# EAGLE design TermometrZbiornikaAkumulacyjnego (EAGLE 6.4)
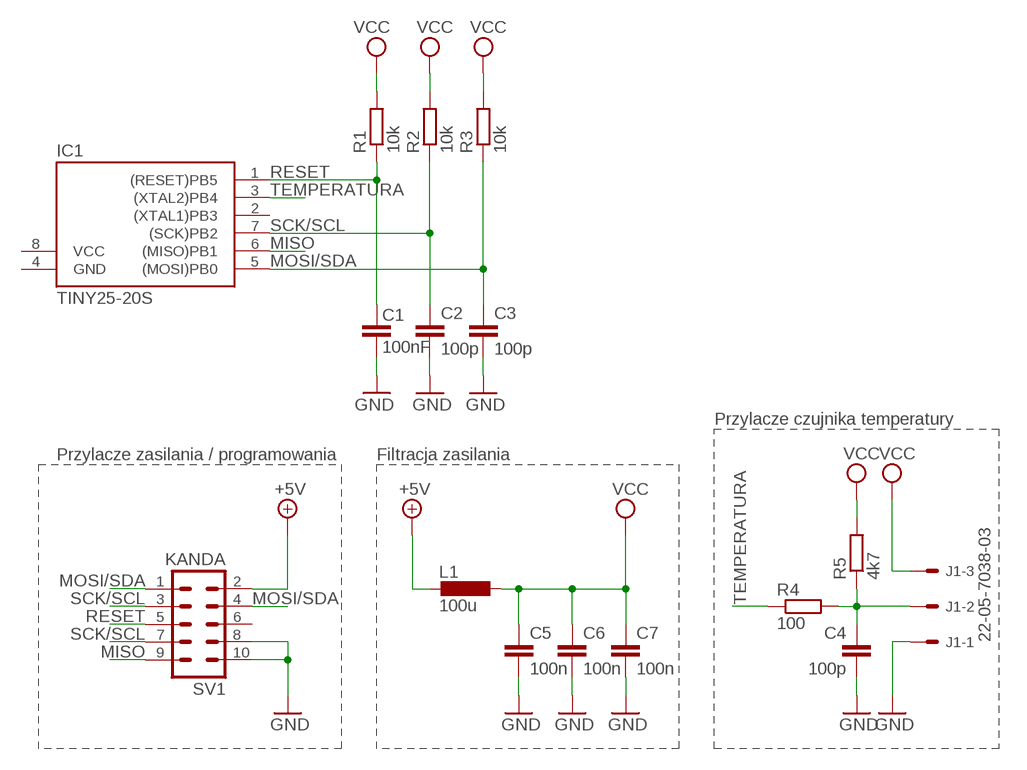
[diagram p0: schematic, sheet 1]

## Parts
C1  100nF  C-EUC1206  [C1206]
C2  100p  C-EUC1206  [C1206]
C3  100p  C-EUC1206  [C1206]
C4  100p  C-EUC1206  [C1206]
C5  100n  C-EUC1206  [C1206]
C6  100n  C-EUC1206  [C1206]
C7  100n  C-EUC1206  [C1206]
IC1  TINY25-20S  [SOIC8]
J1  22-05-7038-03  [7395-03]
L1  100u  L-EUL1210  [R1210]
R1  10k  R-EU_R1206  [R1206]
R2  10k  R-EU_R1206  [R1206]
R3  10k  R-EU_R1206  [R1206]
R4  100  R-EU_R1206  [R1206]
R5  4k7  R-EU_R1206  [R1206]
SV1  KANDA  ML10L  [ML10L]

## Nets
+5V: L1.2 SV1.2
GND: C1.2 C2.2 C3.2 C4.2 C5.2 C6.2 C7.2 J1.1 SV1.8 SV1.10
MISO: IC1.6((MISO)PB1) SV1.9
MOSI/SDA: C3.1 IC1.5((MOSI)PB0) R3.1 SV1.1 SV1.4
N$2: C4.1 J1.2 R4.2 R5.1
RESET: C1.1 IC1.1((RESET)PB5) R1.1 SV1.5
SCK/SCL: C2.1 IC1.7((SCK)PB2) R2.1 SV1.3 SV1.7
TEMPERATURA: IC1.3((XTAL2)PB4) R4.1
VCC: C5.1 C6.1 C7.1 J1.3 L1.1 R1.2 R2.2 R3.2 R5.2
Unconnected: IC1.2((XTAL1)PB3) SV1.6

## Notes on the sheet
- Przylacze czujnika temperatury
- Przylacze zasilania / programowania | Filtracja zasilania

## Power pins joined to a net without a drawn wire
GND: IC1.4(GND)
VCC: IC1.8(VCC)

## Library data of the parts
C1 = resistor:C-EU: CAPACITOR, European symbol
C2-C7 = rcl:C-EU: CAPACITOR, European symbol
IC1 = atmel:TINY25: 8-bit Microcontroller with 2KFlash
J1 = con-molex:22-?-03: CONNECTOR wire to board 2.54 mm (.1 inch) pitch header; OC_FARNELL: unknown; OC_NEWARK: unknown
L1 = rcl:L-EU: INDUCTOR, European symbol
R1-R5 = rcl:R-EU_: RESISTOR, European symbol
SV1 = con-harting-ml:ML10: HARTING; OC_FARNELL: unknown; OC_NEWARK: unknown

## Net classes
0 default: clearance 0.355 mm

## Board
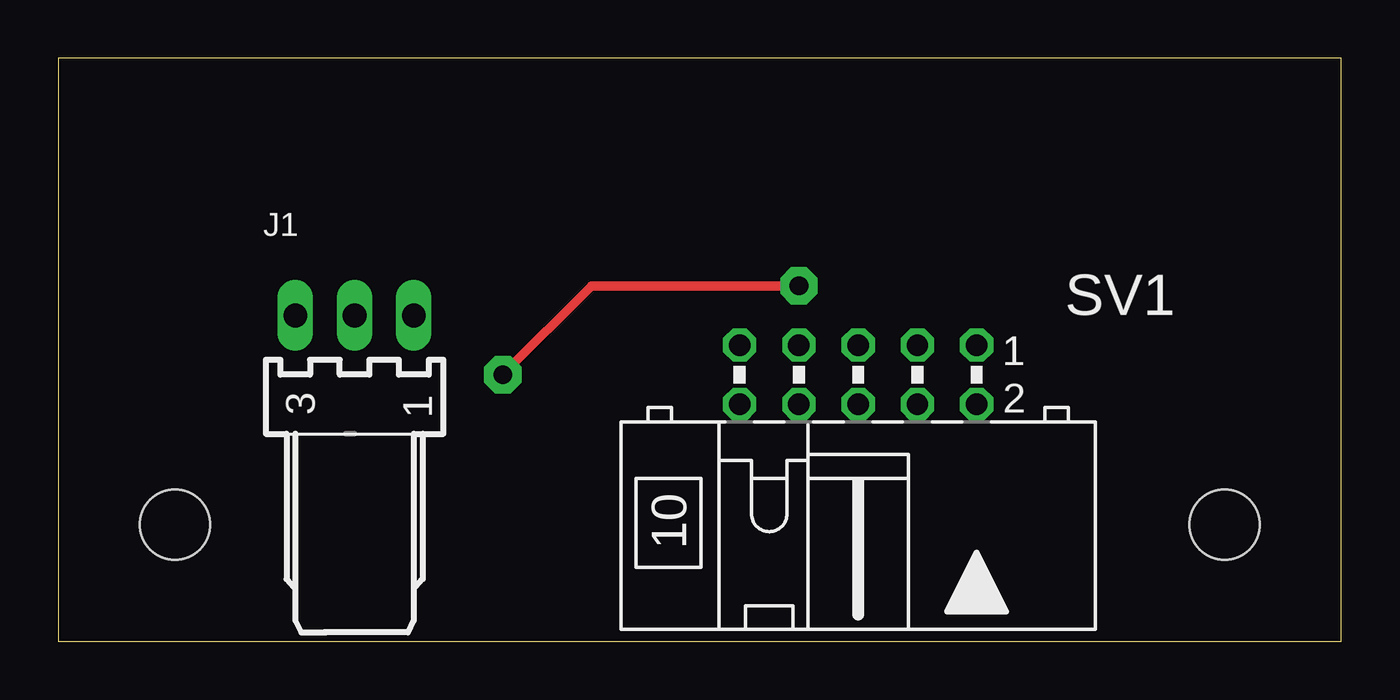
[diagram p1: board, top side]
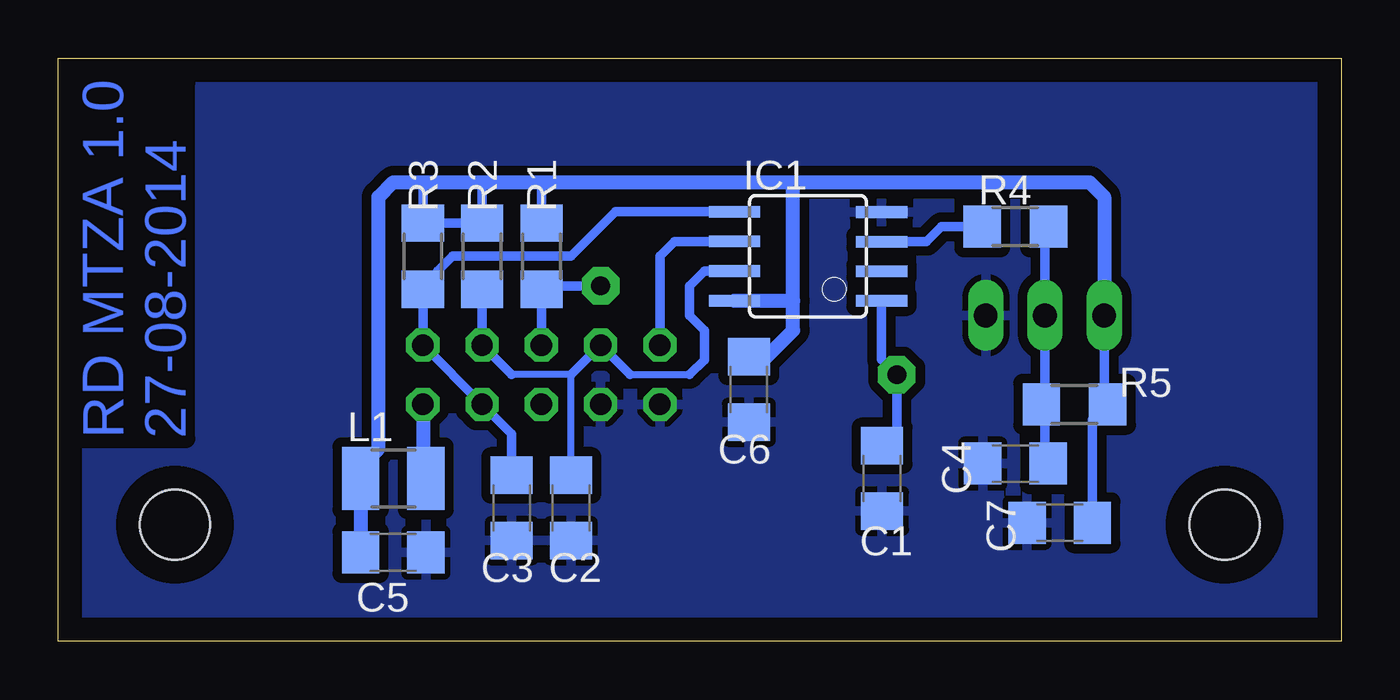
[diagram p2: board, bottom side, seen from below]

Size 55 x 25 mm. Coordinates in mm from the lower left corner, seen from the top.
Outline: 0,0 55,0 55,25 0,25 0,0
Copper layers (1*16): Top 0.035mm / dielectric 1.5mm / Bottom 0.035mm
Design rules "default *": minimum track width 10mil, minimum drill 24mil, track to track 8mil, track to pad 8mil, pad to pad 8mil, via to via 8mil, smd to smd 8mil, copper to edge 40mil, drill to drill 8mil, minimum pad ring 10mil, minimum via ring 8mil, stop-mask expansion 4mil, vias tented up to drill 0mil, thermal gap 10mil
Holes 3 mm at 5,5 50,5

### Footprints (pad centres in the part's own frame; a part is rotated, then mirrored left to right if it is on the bottom)
C1206 = smd 1.6 x 1.8: 1 -1.4,0; 2 1.4,0
SOIC8 = smd 0.5 x 2.2: 1 -1.905,-3.154; 2 -0.645,-3.154; 3 0.625,-3.154; 4 1.895,-3.154; 5 1.905,3.154; 6 0.635,3.154; 7 -0.635,3.154; 8 -1.905,3.154
7395-03 = drill 1.016 long: 1 2.54,0; 2 0,0; 3 -2.54,0
R1210 = smd 1.6 x 2.7: 1 -1.4,0; 2 1.4,0
R1206 = smd 1.6 x 1.803: 1 -1.422,0; 2 1.422,0
ML10L = drill 0.914 octagon: 1 -5.08,-1.27; 2 -5.08,1.27; 3 -2.54,-1.27; 4 -2.54,1.27; 5 0,-1.27; 6 0,1.27; 7 2.54,-1.27; 8 2.54,1.27; 9 5.08,-1.27; 10 5.08,1.27

### Placement (x,y rotation side)
C1  19.68,6.99 270 bottom
C2  33.02,5.71 270 bottom
C3  35.56,5.71 270 bottom
C4  13.97,7.62 180 bottom
C5  40.64,3.81 0 bottom
C6  25.4,10.79 270 bottom
C7  12.06,5.08 180 bottom
IC1  22.86,16.51 90 bottom
J1  12.7,13.97 0 top
L1  40.64,6.99 0 bottom
R1  34.29,16.51 90 bottom
R2  36.83,16.51 90 bottom
R3  39.37,16.51 90 bottom
R4  13.97,17.78 0 bottom
R5  11.43,10.16 0 bottom
SV1  34.29,11.43 180 top

### Tracks (layer width: path | path; a pad name or v marks a point on that pad's centre or on a via)
+5V
  Bottom 0.61: SV1.2 39.37,7.12 L1.2
GND
  pour Bottom (isolate 0.406): -1.27,26.67 -1.27,-1.27 55.88,-1.27 55.88,26.67
MISO
  Bottom 0.406: SV1.9 29.21,16.51 28.57,17.14 IC1.6
MOSI/SDA
  Bottom 0.406: IC1.5 31.11,18.41 33.02,16.51 38.1,16.51 38.73,15.88 38.73,15.72 R3.1 SV1.1 SV1.4 35.56,8.89 C3.1
N$2
  Bottom 0.406: 12.7,10.16 J1.2 12.7,17.63 R4.2 | 12.7,10.16 12.7,7.75 C4.1 | R5.1 12.7,10.16
RESET  (via drill 0.8)
  Top 0.406: v31.75,15.24 22.86,15.24 v19.05,11.43
  Bottom 0.406: C1.1 19.05,9.02 v19.05,11.43 19.71,12.09 IC1.1 | SV1.5 R1.1 34.14,15.24 v31.75,15.24
SCK/SCL
  Bottom 0.305: 30.48,11.43 27.94,11.43 | 35.56,11.43 33.02,11.43 C2.1
  Bottom 0.406: 30.48,11.43 SV1.7 33.02,11.43 | 27.94,11.43 27.3,12.06 27.3,13.34 27.94,13.97 27.94,15.24 27.3,15.88 IC1.7 | 35.56,11.43 SV1.3 R2.1
TEMPERATURA
  Bottom 0.406: IC1.3 17.79,17.14 17.14,17.78 R4.1
VCC
  Bottom 0.406: J1.3 10.16,10.31 R5.2 10.66,9.5 C7.1 | 39.37,19.68 R3.2 R2.2 36.83,19.68 | R1.2 34.29,19.68
  Bottom 0.61: C5.1 L1.1 42.04,7.49 41.27,8.26 41.27,19.05 40.64,19.68 39.37,19.68 36.83,19.68 34.29,19.68 23.5,19.68 | 23.5,19.68 10.79,19.68 10.16,19.05 J1.3 | 23.5,14.61 23.5,13.34 24.64,12.2 C6.1 | 23.5,14.61 23.5,19.68 | IC1.8 23.5,14.61

### Text on the board
Bottom: RD MTZA 1.0 / 27-08-2014